# EAGLE schematic Artemis_Iridium_Tracker (EAGLE 9.5.2)

## Sheet 1 of 4
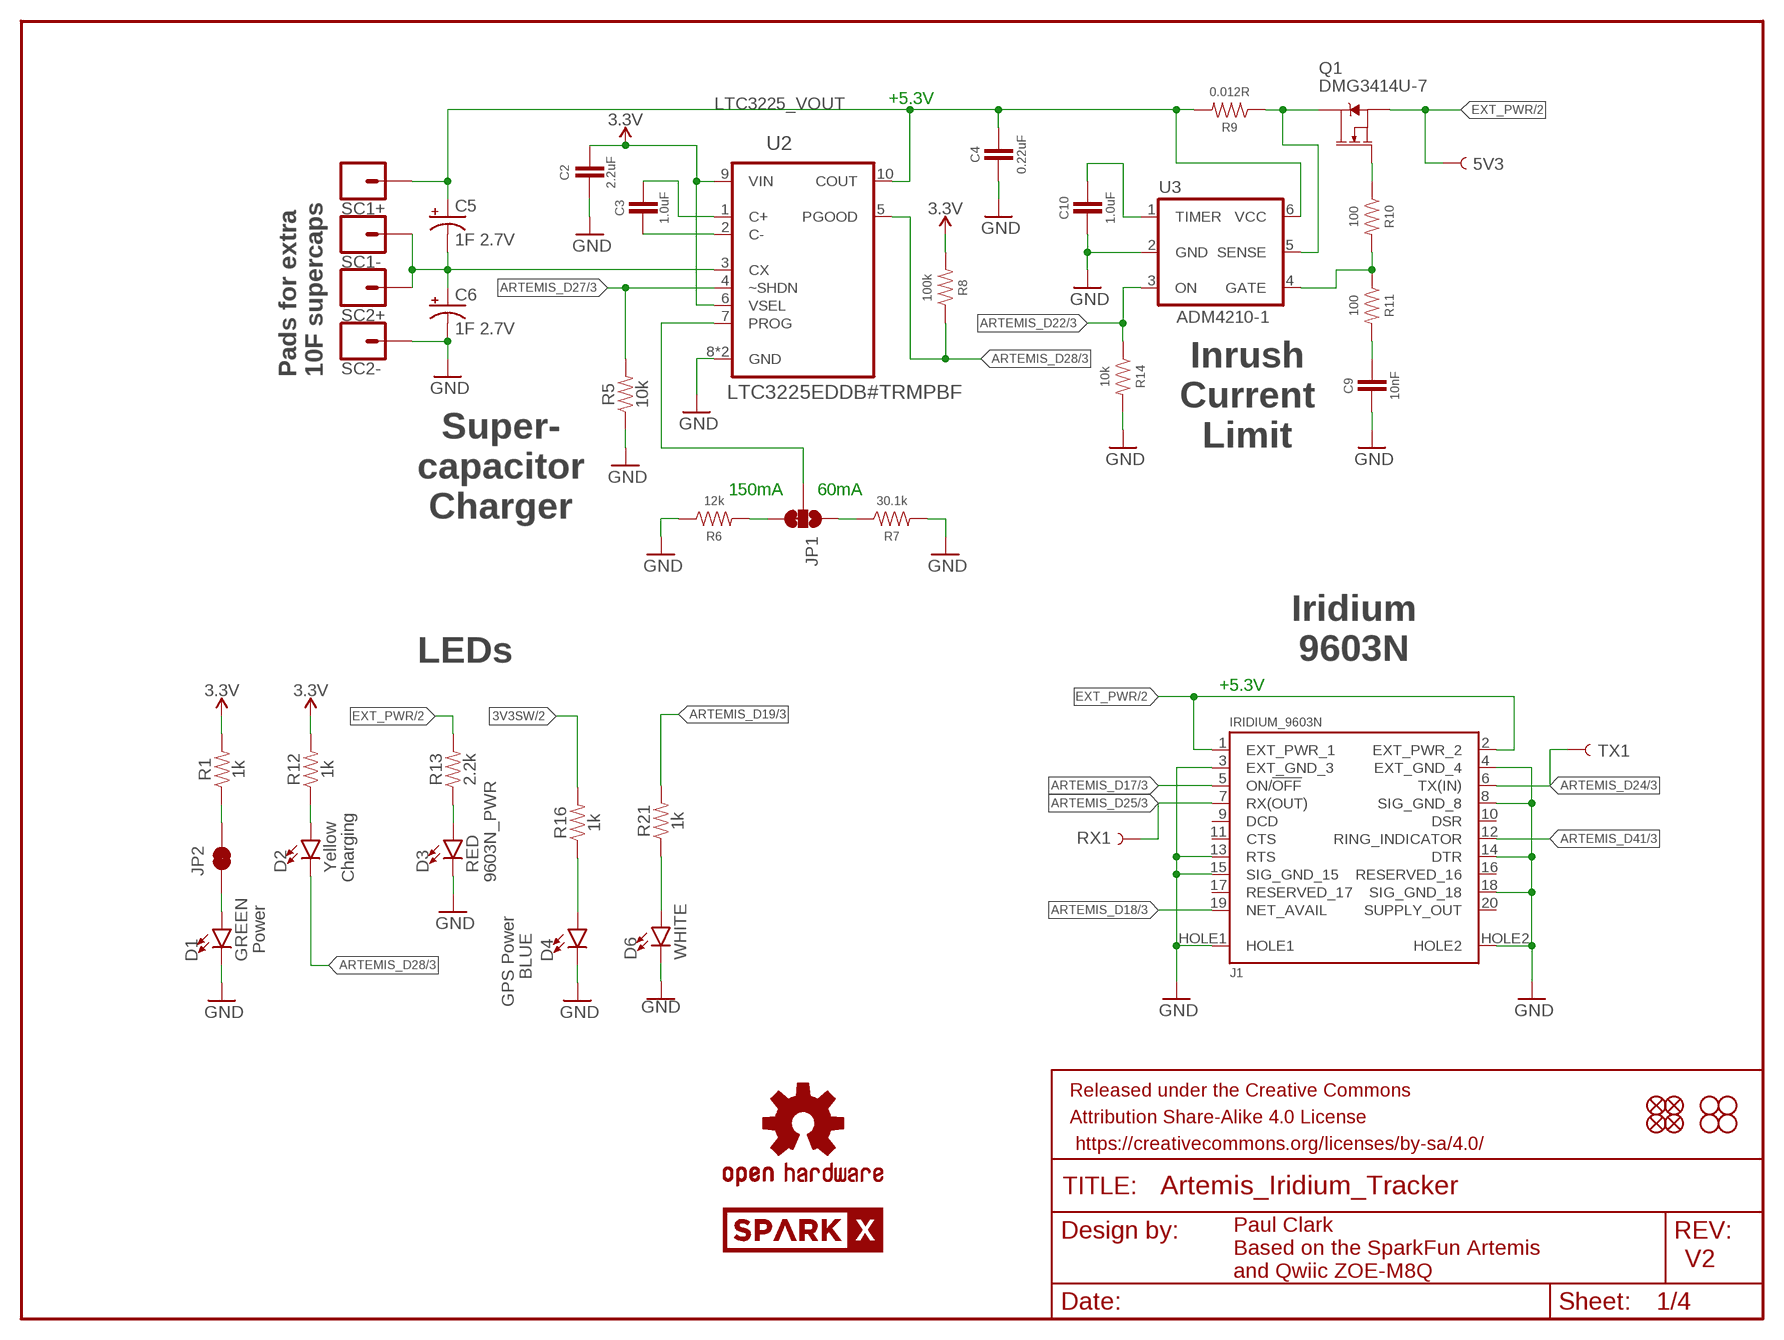
[diagram p0: schematic, sheet 1]

### Parts
5V3  TEST-POINT3X5  [PAD.03X.05]
C2  2.2uF  2.2UF-0603-10V-20%  [0603]
C3  1.0uF  1.0UF-0603-16V-10%-X7R  [0603]
C4  0.22uF  0.22UF-0603-25V-10%  [0603]
C5  1F 2.7V  1F-2.7V(PTH)CPOL-RADIAL-1H-2.7V  [CPOL-RADIAL-1F-2.7V]
C6  1F 2.7V  1F-2.7V(PTH)CPOL-RADIAL-1H-2.7V  [CPOL-RADIAL-1F-2.7V]
C9  10nF  10NF-0603-50V-10%  [0603]
C10  1.0uF  1.0UF-0603-16V-10%-X7R  [0603]
D1  GREEN  LED-GREEN0603  [LED-0603]
D2  Yellow  LED-YELLOW0603  [LED-0603]
D3  RED  LED-RED0603  [LED-0603]
D4  BLUE  LED-BLUE0603  [LED-0603]
D6  WHITE  LED-WHITE0603  [LED-0603]
FRAME1  FRAME-LETTER  [CREATIVE_COMMONS]
J1  IRIDIUM_9603N  [IRIDIUM_9603N]
JP1  JUMPER-SMT_3_1-NC_TRACE_SILK  [SMT-JUMPER_3_1-NC_TRACE_SILK]
JP2  JUMPER-SMT_2_NC_TRACE_SILK  [SMT-JUMPER_2_NC_TRACE_SILK]
JP7  FIDUCIAL1X2  [FIDUCIAL-1X2]
JP8  FIDUCIAL1X2  [FIDUCIAL-1X2]
JP9  STAND-OFF  [STAND-OFF]
JP10  STAND-OFF  [STAND-OFF]
JP11  STAND-OFF  [STAND-OFF]
JP12  STAND-OFF  [STAND-OFF]
JP13  FIDUCIAL1X2  [FIDUCIAL-1X2]
JP14  FIDUCIAL1X2  [FIDUCIAL-1X2]
LOGO4  OSHW-LOGOMINI  [OSHW-LOGO-MINI]
Q1  DMG3414U-7  [SOT23-R]
R1  1k  1KOHM-0603-1/10W-1%  [0603]
R5  10k  10KOHM-0603-1/10W-1%  [0603]
R6  12k  12KOHM-0603-1/10W-1%  [0603]
R7  30.1k  30.1KOHM-0603-1/10W-1%  [0603]
R8  100k  100KOHM-0603-1/10W-1%  [0603]
R9  0.012R  RESISTOR_0603_12MILLIOHM0603  [0603]
R10  100  100OHM-0603-1/10W-1%  [0603]
R11  100  100OHM-0603-1/10W-1%  [0603]
R12  1k  1KOHM-0603-1/10W-1%  [0603]
R13  2.2k  2.2KOHM-0603-1/10W-1%  [0603]
R14  10k  10KOHM-0603-1/10W-1%  [0603]
R16  1k  1KOHM-0603-1/10W-1%  [0603]
R21  1k  1KOHM-0603-1/10W-1%  [0603]
RX1  TEST-POINT3X5  [PAD.03X.05]
SC1+  CONN_01PTH_NO_SILK_YES_STOP  [1X01_NO_SILK]
SC1-  CONN_01PTH_NO_SILK_YES_STOP  [1X01_NO_SILK]
SC2+  CONN_01PTH_NO_SILK_YES_STOP  [1X01_NO_SILK]
SC2-  CONN_01PTH_NO_SILK_YES_STOP  [1X01_NO_SILK]
SPARKX1  SPARKX-LOGO4  [SPARKX-MEDIUM]
SPARKX2  SPARKX-LOGO4  [SPARKX-MEDIUM]
TX1  TEST-POINT3X5  [PAD.03X.05]
U2  LTC3225EDDB#TRMPBF  LTC3225EDDB-TRMPBFDFN300X200-10L  [DFN300X200-10L]
U3  ADM4210-1  [TSOT6]

### Nets
3.3V [3.3V]: C2.1 R1.2 R8.2 R12.2 U2.6(VSEL) U2.9(VIN) ; also sheet 2,3,4
3V3SW: R16.2 ; also sheet 2
ARTEMIS_D17: J1.5(ON/!OFF!) ; also sheet 3
ARTEMIS_D18: J1.19(NET_AVAIL) ; also sheet 3
ARTEMIS_D19: R21.2 ; also sheet 3
ARTEMIS_D22: R14.1 U3.3(ON) ; also sheet 3
ARTEMIS_D24: J1.6(TX(IN)) TX1.P$1 ; also sheet 3
ARTEMIS_D25: J1.7(RX(OUT)) RX1.P$1 ; also sheet 3
ARTEMIS_D27: R5.2 U2.4(~SHDN) ; also sheet 3
ARTEMIS_D28: D2.C R8.1 U2.5(PGOOD) ; also sheet 3
ARTEMIS_D41: J1.12(RING_INDICATOR) ; also sheet 3
EXT_PWR: 5V3.P$1 J1.1(EXT_PWR_1) J1.2(EXT_PWR_2) Q1.2(S) R13.2 ; also sheet 2
GND: C2.2 C4.2 C6.- C9.2 C10.2 D1.C D3.C D4.C D6.C J1.3(EXT_GND_3) J1.4(EXT_GND_4) J1.8(SIG_GND_8) J1.13(RTS) J1.14(DTR) J1.15(SIG_GND_15) J1.18(SIG_GND_18) J1.HOLE1 J1.HOLE2 R5.1 R6.1 R7.2 R14.2 SC2-.1 U2.8(GND) U2.11(GND) U3.2(GND) ; also sheet 2,3,4
LTC3225_VOUT: C4.1 C5.+ R9.2 SC1+.1 U2.10(COUT) U3.6(VCC)
N$1: C5.- C6.+ SC1-.1 SC2+.1 U2.3(CX)
N$2: JP1.3 R6.2
N$3: JP2.2 R1.1
N$4: JP1.1 R7.1
N$5: D2.A R12.1
N$6: D3.A R13.1
N$8: Q1.3(D) R9.1 U3.5(SENSE)
N$9: C3.2 U2.2(C-)
N$10: C3.1 U2.1(C+)
N$11: JP1.2 U2.7(PROG)
N$12: Q1.1(G) R10.1
N$13: R10.2 R11.1 U3.4(GATE)
N$14: C9.1 R11.2
N$15: C10.1 U3.1(TIMER)
N$21: D4.A R16.1
N$23: D1.A JP2.1
N$35: D6.A R21.1
Unconnected: J1.9(DCD) J1.10(DSR) J1.11(CTS) J1.16(RESERVED_16) J1.17(RESERVED_17) J1.20(SUPPLY_OUT)

### Notes on the sheet
- +5.3V
- Inrush
  Current
  Limit
- Pads for extra
  10F supercaps
- Super-
  capacitor
  Charger
- 150mA | 60mA
- Iridium
  9603N
- LEDs
- +5.3V
- Charging | 9603N_PWR
- Power
- GPS Power
- V2
- Paul Clark
  Based on the SparkFun Artemis
  and Qwiic ZOE-M8Q

## Sheet 2 of 4
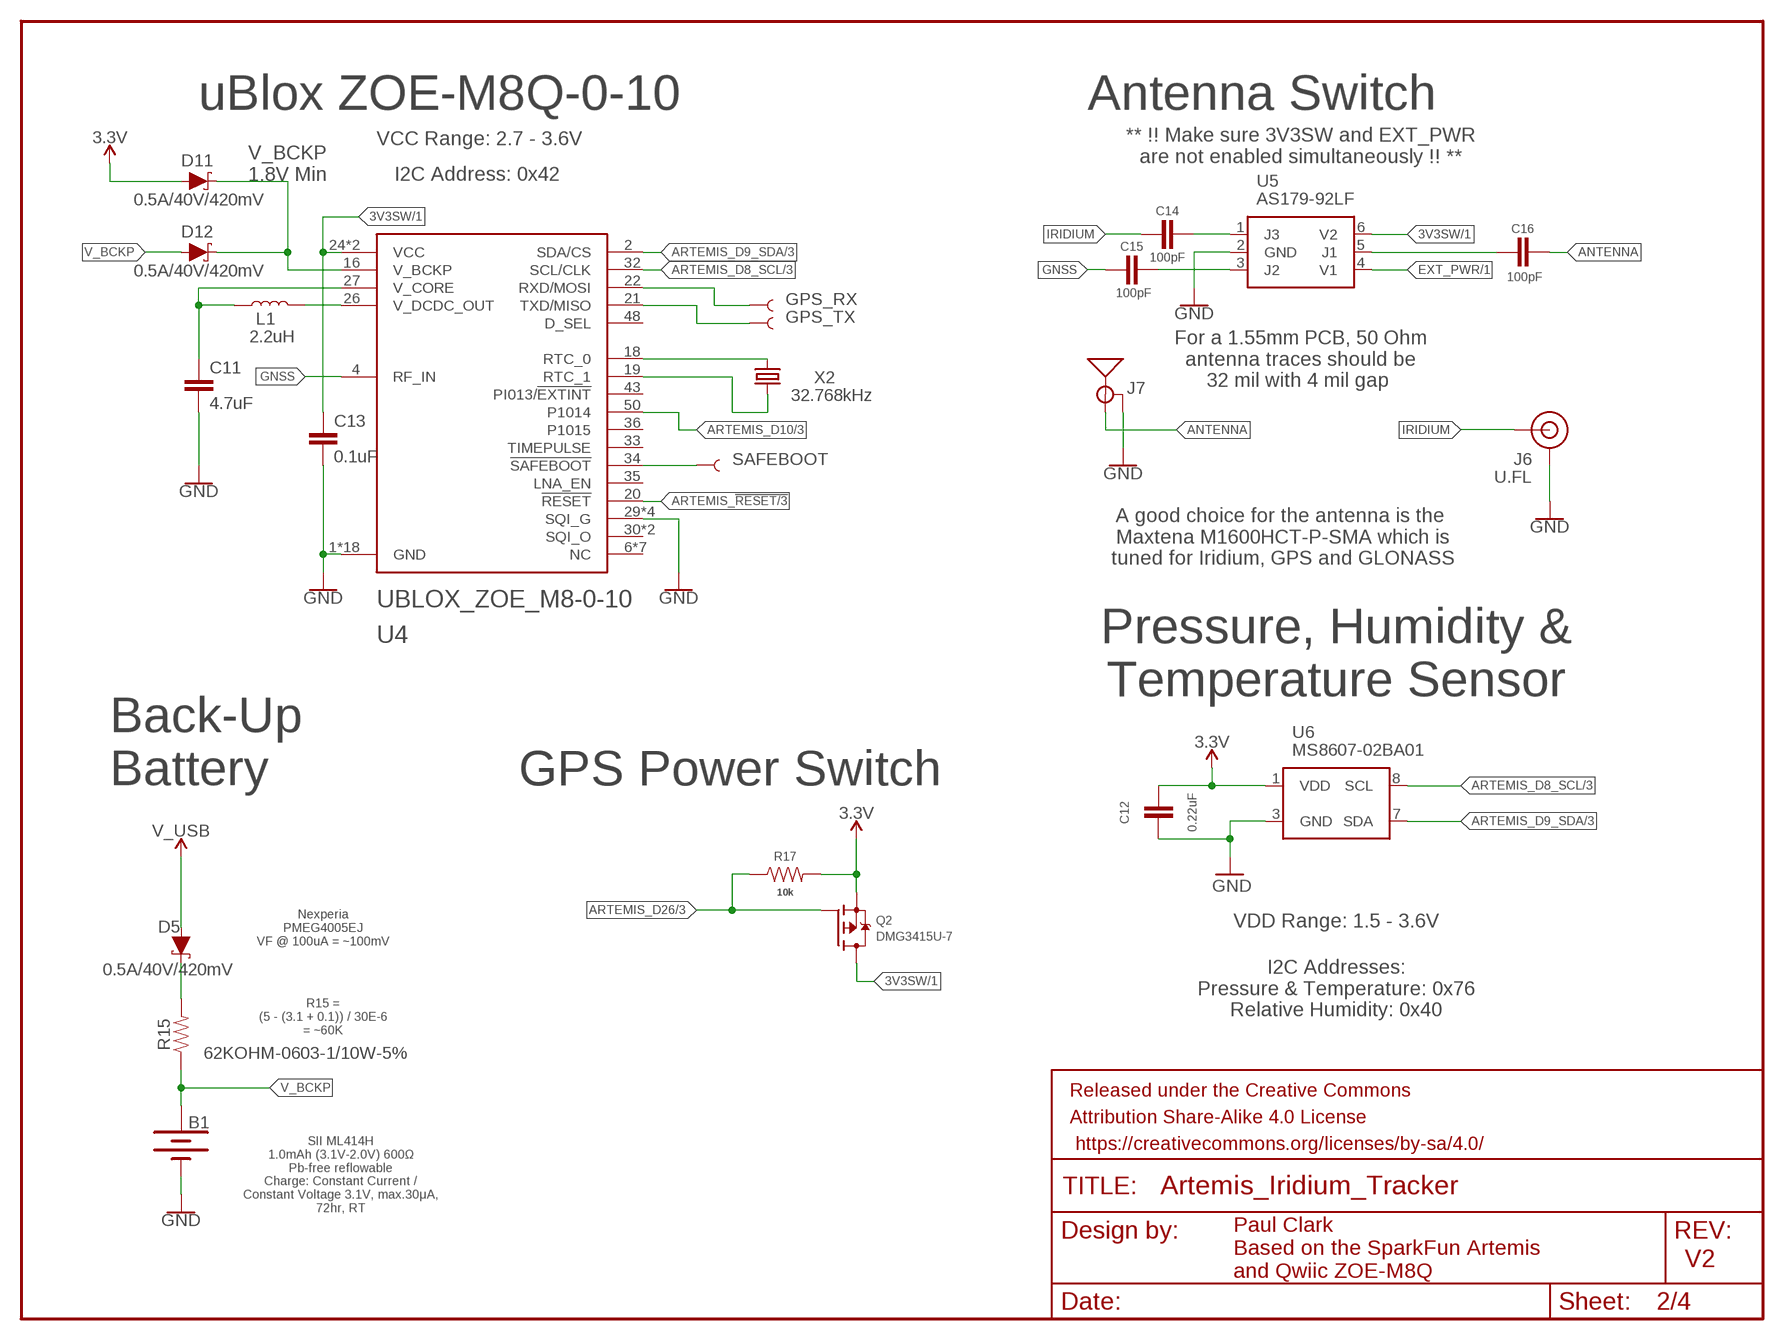
[diagram p1: schematic, sheet 2]

### Parts
B1  ML414H_IV01E_BATTERY  [ML414H_IV01E]
C11  4.7uF  4.7UF-0603-6.3V-(10%)  [0603]
C12  0.22uF  0.22UF-0603-25V-10%  [0603]
C13  0.1uF  0.1UF-0603-25V-(+80/-20%)  [0603]
C14  100pF  100PF-0603-50V-5%  [0603]
C15  100pF  100PF-0603-50V-5%  [0603]
C16  100pF  100PF-0603-50V-5%  [0603]
D5  0.5A/40V/420mV  DIODE-SCHOTTKY-PMEG4005EJ  [SOD-323]
D11  0.5A/40V/420mV  DIODE-SCHOTTKY-PMEG4005EJ  [SOD-323]
D12  0.5A/40V/420mV  DIODE-SCHOTTKY-PMEG4005EJ  [SOD-323]
FRAME2  FRAME-LETTER  [CREATIVE_COMMONS]
GPS_RX  TEST-POINT3X5  [PAD.03X.05]
GPS_TX  TEST-POINT3X5  [PAD.03X.05]
J6  U.FL  U.FL2PIN  [U.FL]
J7  ANTENNA-GROUNDEDEDGE_SMA  [SMA-EDGE]
L1  2.2uH  2.2μH_SHIELDED_INDUCTOR  [0806]
Q2  DMG3415U-7  DMG3415U  [SOT23-R]
R15  62KOHM-0603-1/10W-5%  [0603]
R17  10k  10KOHM-0603-1/10W-1%  [0603]
SAFEBOOT  TEST-POINT3X5  [PAD.03X.05]
U4  UBLOX_ZOE_M8-0-10  [UBLOX_ZOE_M8-0-10]
U5  AS179-92LF  [SOT65P220X100-6N]
U6  MS8607-02BA01  [MS8607-02BA01]
X2  32.768kHz  CRYSTAL-32.768KHZSMD-3.2X1.5  [CRYSTAL-SMD-3.2X1.5MM]

### Nets
3.3V [3.3V]: C12.1 D11.A Q2.2(S) R17.2 U6.1(VDD) ; also sheet 1,3,4
3V3SW: C13.1 Q2.3(D) U4.24(VCC) U4.25(VCC) U5.6(V2) ; also sheet 1
ANTENNA: C16.1 J7.SIG(SIGNAL)
ARTEMIS_!RESET: U4.20(!RESET) ; also sheet 3
ARTEMIS_D8_SCL: U4.32(SCL/CLK) U6.8(SCL) ; also sheet 3
ARTEMIS_D9_SDA: U4.2(SDA/CS) U6.7(SDA) ; also sheet 3
ARTEMIS_D10: U4.50(P1014) ; also sheet 3
ARTEMIS_D26: Q2.1(G) R17.1 ; also sheet 3
EXT_PWR: U5.4(V1) ; also sheet 1
GND: B1.- C11.2 C12.2 C13.2 J6.1(GND) J6.2(GND) J7.GND@0(GND) J7.GND@1(GND) J7.GND@2(GND) J7.GND@3(GND) U4.1(GND) U4.3(GND) U4.5(GND) U4.7(GND) U4.8(GND) U4.9(GND) U4.10(GND) U4.11(GND) U4.12(GND) U4.17(GND) U4.23(GND) U4.29(SQI_G) U4.31(SQI_G) U4.37(GND) U4.38(GND) U4.39(GND) U4.40(GND) U4.41(GND) U4.44(GND) U4.46(SQI_G) U4.47(SQI_G) U4.49(GND) U5.2(GND) U6.3(GND) ; also sheet 1,3,4
GNSS: C15.2 U4.4(RF_IN)
IRIDIUM: C14.2 J6.FEED(SIGNAL)
N$16: L1.2 U4.26(V_DCDC_OUT)
N$17: C11.1 L1.1 U4.27(V_CORE)
N$18: U4.18(RTC_0) X2.P$2
N$19: U4.19(RTC_1) X2.P$1
N$20: D5.C R15.2
N$24: D11.C D12.C U4.16(V_BCKP)
N$25: SAFEBOOT.P$1 U4.34(!SAFEBOOT)
N$26: GPS_RX.P$1 U4.22(RXD/MOSI)
N$27: GPS_TX.P$1 U4.21(TXD/MISO)
N$28: C14.1 U5.1(J3)
N$29: C15.1 U5.3(J2)
N$30: C16.2 U5.5(J1)
V_BCKP: B1.+ D12.A R15.1
V_USB: D5.A ; also sheet 4
Unconnected: U4.6(NC) U4.13(NC) U4.14(NC) U4.15(NC) U4.28(NC) U4.30(SQI_O) U4.33(TIMEPULSE) U4.35(LNA_EN) U4.36(P1015) U4.42(NC) U4.43(PI013/!EXTINT) U4.45(SQI_O) U4.48(D_SEL) U4.51(NC)

### Notes on the sheet
- uBlox ZOE-M8Q-0-10 | Antenna Switch
- VCC Range: 2.7 - 3.6V
- ** !! Make sure 3V3SW and EXT_PWR
  are not enabled simultaneously !! **
- V_BCKP
  1.8V Min
- I2C Address: 0x42
- For a 1.55mm PCB, 50 Ohm
  antenna traces should be
  32 mil with 4 mil gap
- A good choice for the antenna is the 
  Maxtena M1600HCT-P-SMA which is
  tuned for Iridium, GPS and GLONASS
- Pressure, Humidity &
  Temperature Sensor
- Back-Up
  Battery
- GPS Power Switch
- VDD Range: 1.5 - 3.6V
- Nexperia
  PMEG4005EJ
  VF @ 100uA = ~100mV
- I2C Addresses:
  Pressure & Temperature: 0x76
  Relative Humidity: 0x40
- R15 =
  (5 - (3.1 + 0.1)) / 30E-6
  = ~60K
- SII ML414H
  1.0mAh (3.1V-2.0V) 600Ω
  Pb-free reflowable
  Charge: Constant Current /
  Constant Voltage 3.1V, max.30μA,
  72hr, RT
- V2
- Paul Clark
  Based on the SparkFun Artemis
  and Qwiic ZOE-M8Q

## Sheet 3 of 4
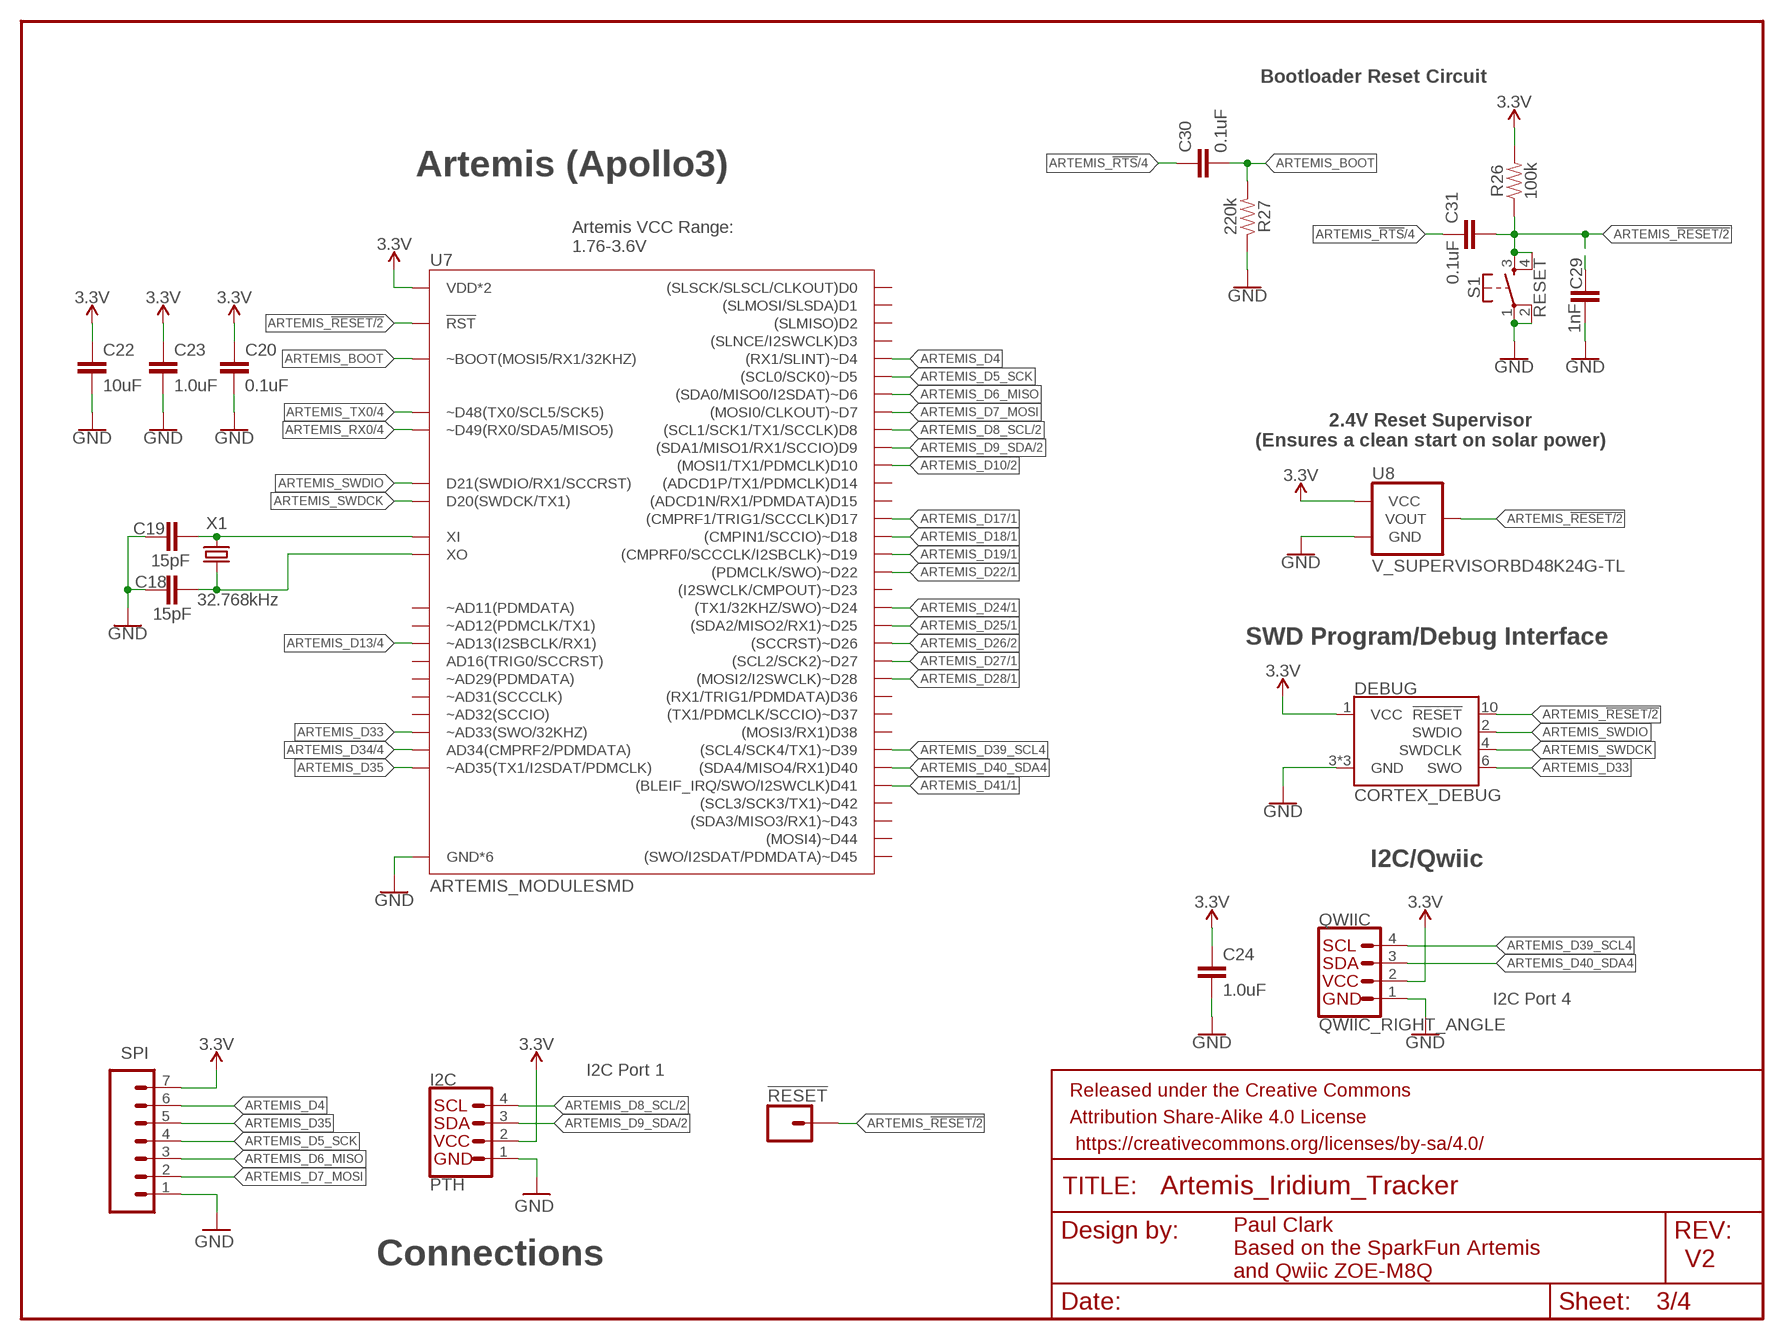
[diagram p2: schematic, sheet 3]

### Parts
!RESET  CONN_01PTH_NO_SILK_YES_STOP  [1X01_NO_SILK]
C18  15pF  15PF-0603-50V-5%  [0603]
C19  15pF  15PF-0603-50V-5%  [0603]
C20  0.1uF  0.1UF-0603-25V-(+80/-20%)  [0603]
C22  10uF  10UF-0603-6.3V-20%  [0603]
C23  1.0uF  1.0UF-0603-16V-10%  [0603]
C24  1.0uF  1.0UF-0603-16V-10%  [0603]
C29  1nF  1.0NF/1000PF-0603-50V-10%  [0603]
C30  0.1uF  0.1UF-0603-25V-5%  [0603]
C31  0.1uF  0.1UF-0603-25V-5%  [0603]
DEBUG  CORTEX_DEBUG  CORTEX_JTAG_DEBUG_MINIMUM_PTH_NS  [2X5-PTH-1.27MM-NO_SILK]
FRAME3  FRAME-LETTER  [CREATIVE_COMMONS]
I2C  PTH  I2C_STANDARD_NO_SILK  [1X04_NO_SILK]
QWIIC  QWIIC_RIGHT_ANGLE  QWIIC_CONNECTORJS-1MM  [JST04_1MM_RA]
R26  100k  100KOHM-0603-1/10W-1%  [0603]
R27  220k  220KOHM-0603-1/10W-1%  [0603]
S1  RESET  MOMENTARY-SWITCH-SPST-2-SMD-5.2MM-TALL  [TACTILE_SWITCH_SMD_5.2MM]
SPI  CONN_07NO_SILK  [1X07_NO_SILK]
U7  ARTEMIS_MODULESMD  [ARTEMIS_FP]
U8  V_SUPERVISORBD48K24G-TL  [SSOP3]
X1  32.768kHz  CRYSTAL-32.768KHZSMD-3.2X1.5  [CRYSTAL-SMD-3.2X1.5MM]

### Nets
3.3V [3.3V]: C20.2 C22.1 C23.1 C24.1 DEBUG.1(VCC) I2C.2 QWIIC.2 R26.2 SPI.7 U7.VDD@36(VDD*2) U7.VDD@37(VDD*2) U8.3(VCC) ; also sheet 1,2,4
ARTEMIS_!RESET: !RESET.1 C29.1 C31.2 DEBUG.10(!RESET) R26.1 S1.3 S1.4 U7.~RST(!RST) U8.2(VOUT) ; also sheet 2
ARTEMIS_!RTS!: C30.1 C31.1 ; also sheet 4
ARTEMIS_BOOT: C30.2 R27.2 U7.BOOT(~BOOT(MOSI5/RX1/32KHZ))
ARTEMIS_D4: SPI.6 U7.~D4((RX1/SLINT)~D4)
ARTEMIS_D5_SCK: SPI.4 U7.~D5((SCL0/SCK0)~D5)
ARTEMIS_D6_MISO: SPI.3 U7.~D6((SDA0/MISO0/I2SDAT)~D6)
ARTEMIS_D7_MOSI: SPI.2 U7.D7((MOSI0/CLKOUT)~D7)
ARTEMIS_D8_SCL: I2C.4 U7.D8((SCL1/SCK1/TX1/SCCLK)D8) ; also sheet 2
ARTEMIS_D9_SDA: I2C.3 U7.D9((SDA1/MISO1/RX1/SCCIO)D9) ; also sheet 2
ARTEMIS_D10: U7.D10((MOSI1/TX1/PDMCLK)D10) ; also sheet 2
ARTEMIS_D13: U7.~AD13(~AD13(I2SBCLK/RX1)) ; also sheet 4
ARTEMIS_D17: U7.D17((CMPRF1/TRIG1/SCCCLK)D17) ; also sheet 1
ARTEMIS_D18: U7.~D18((CMPIN1/SCCIO)~D18) ; also sheet 1
ARTEMIS_D19: U7.~D19((CMPRF0/SCCCLK/I2SBCLK)~D19) ; also sheet 1
ARTEMIS_D22: U7.~D22((PDMCLK/SWO)~D22) ; also sheet 1
ARTEMIS_D24: U7.~D24((TX1/32KHZ/SWO)~D24) ; also sheet 1
ARTEMIS_D25: U7.~D25((SDA2/MISO2/RX1)~D25) ; also sheet 1
ARTEMIS_D26: U7.~D26((SCCRST)~D26) ; also sheet 2
ARTEMIS_D27: U7.~D27((SCL2/SCK2)~D27) ; also sheet 1
ARTEMIS_D28: U7.~D28((MOSI2/I2SWCLK)~D28) ; also sheet 1
ARTEMIS_D33: DEBUG.6(SWO) U7.~AD33/SWO(~AD33(SWO/32KHZ))
ARTEMIS_D34: U7.AD34(AD34(CMPRF2/PDMDATA)) ; also sheet 4
ARTEMIS_D35: SPI.5 U7.~AD35(~AD35(TX1/I2SDAT/PDMCLK))
ARTEMIS_D39_SCL4: QWIIC.4 U7.~D39((SCL4/SCK4/TX1)~D39)
ARTEMIS_D40_SDA4: QWIIC.3 U7.D40((SDA4/MISO4/RX1)D40)
ARTEMIS_D41: U7.D41((BLEIF_IRQ/SWO/I2SWCLK)D41) ; also sheet 1
ARTEMIS_RX0: U7.RXI-0(~D49(RX0/SDA5/MISO5)) ; also sheet 4
ARTEMIS_SWDCK: DEBUG.4(SWDCLK) U7.SWDCK(D20(SWDCK/TX1))
ARTEMIS_SWDIO: DEBUG.2(SWDIO) U7.SWDIO(D21(SWDIO/RX1/SCCRST))
ARTEMIS_TX0: U7.TXO-0(~D48(TX0/SCL5/SCK5)) ; also sheet 4
GND: C18.1 C19.1 C20.1 C22.2 C23.2 C24.2 C29.2 DEBUG.3(GND) DEBUG.5(GND) DEBUG.9(GND) I2C.1 QWIIC.1 R27.1 S1.1 S1.2 SPI.1 U7.GND@1(GND*6) U7.GND@22(GND*6) U7.GND@38(GND*6) U7.GND@39(GND*6) U7.GND@47(GND*6) U7.GND@59(GND*6) U8.1(GND) ; also sheet 1,2,4
XTALI: C19.2 U7.XI X1.P$1
XTALO: C18.2 U7.XO X1.P$2
Unconnected: U7.AD16(AD16(TRIG0/SCCRST)) U7.D0((SLSCK/SLSCL/CLKOUT)D0) U7.D1((SLMOSI/SLSDA)D1) U7.D2((SLMISO)D2) U7.D3((SLNCE/I2SWCLK)D3) U7.D14((ADCD1P/TX1/PDMCLK)D14) U7.D15((ADCD1N/RX1/PDMDATA)D15) U7.D36((RX1/TRIG1/PDMDATA)D36) U7.D38((MOSI3/RX1)D38) U7.~AD11(~AD11(PDMDATA)) U7.~AD12(~AD12(PDMCLK/TX1)) U7.~AD29(~AD29(PDMDATA)) U7.~AD31(~AD31(SCCCLK)) U7.~AD32(~AD32(SCCIO)) U7.~D23((I2SWCLK/CMPOUT)~D23) U7.~D37((TX1/PDMCLK/SCCIO)~D37) U7.~D42((SCL3/SCK3/TX1)~D42) U7.~D43((SDA3/MISO3/RX1)~D43) U7.~D44((MOSI4)~D44) U7.~D45((SWO/I2SDAT/PDMDATA)~D45)

### Notes on the sheet
- Bootloader Reset Circuit
- Artemis (Apollo3)
- Artemis VCC Range:
  1.76-3.6V
- 2.4V Reset Supervisor
  (Ensures a clean start on solar power)
- SWD Program/Debug Interface
- I2C/Qwiic
- I2C Port 4
- I2C Port 1
- Connections | V2
- Paul Clark
  Based on the SparkFun Artemis
  and Qwiic ZOE-M8Q

## Sheet 4 of 4
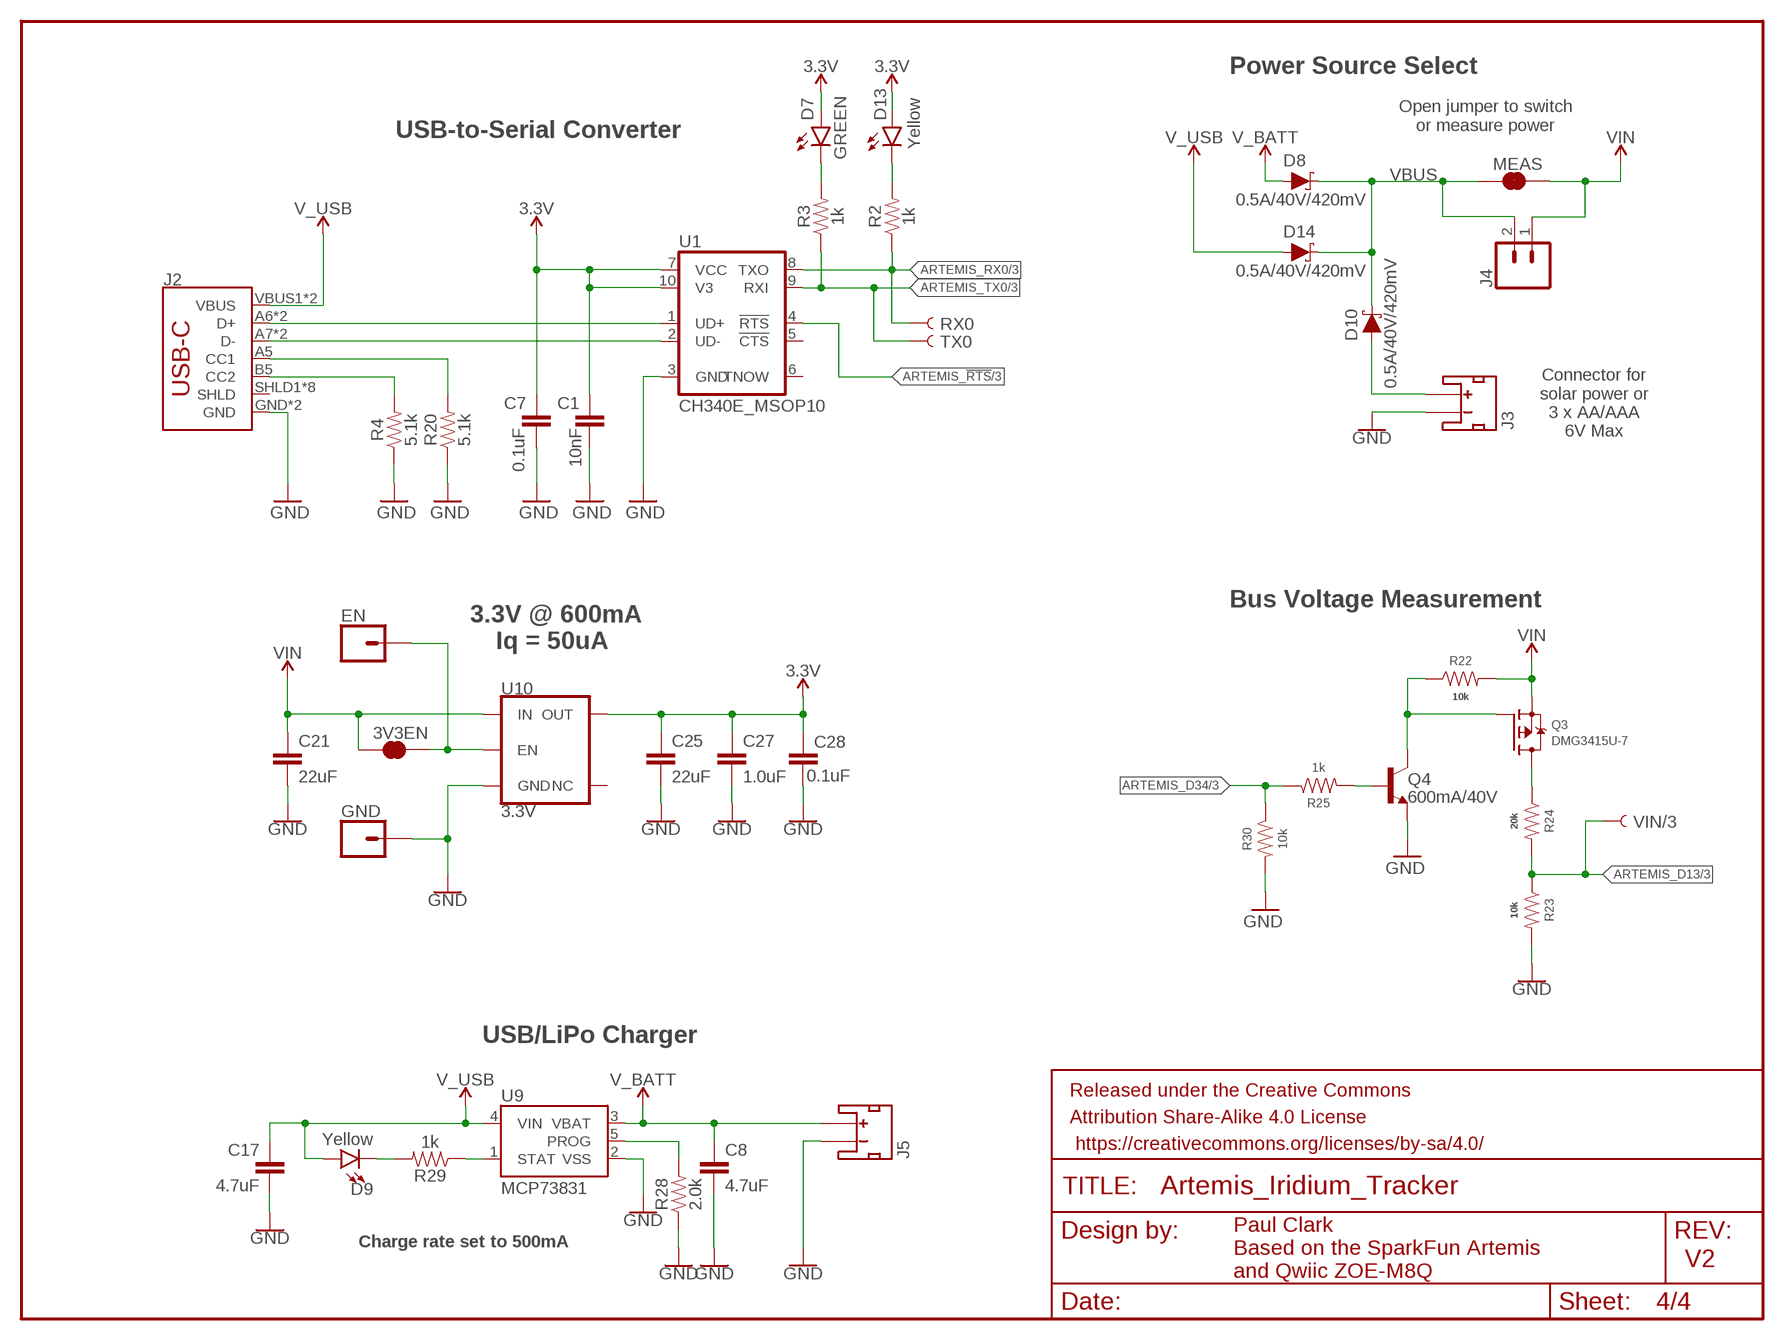
[diagram p3: schematic, sheet 4]

### Parts
3V3EN  JUMPER-SMT_2_NC_TRACE_SILK  [SMT-JUMPER_2_NC_TRACE_SILK]
C1  10nF  10NF-0603-50V-10%  [0603]
C7  0.1uF  0.1UF-0603-25V-(+80/-20%)  [0603]
C8  4.7uF  4.7UF-0603-6.3V-(10%)  [0603]
C17  4.7uF  4.7UF-0603-6.3V-(10%)  [0603]
C21  22uF  22UF-0805-16V-20%  [0805]
C25  22uF  22UF-0603-6.3V-20%  [0603]
C27  1.0uF  1.0UF-0603-16V-10%  [0603]
C28  0.1uF  0.1UF-0603-25V-(+80/-20%)  [0603]
D7  GREEN  LED-GREEN0603  [LED-0603]
D8  0.5A/40V/420mV  DIODE-SCHOTTKY-PMEG4005EJ  [SOD-323]
D9  Yellow  LED-YELLOW0603  [LED-0603]
D10  0.5A/40V/420mV  DIODE-SCHOTTKY-PMEG4005EJ  [SOD-323]
D13  Yellow  LED-YELLOW0603  [LED-0603]
D14  0.5A/40V/420mV  DIODE-SCHOTTKY-PMEG4005EJ  [SOD-323]
EN  CONN_01PTH_NO_SILK_YES_STOP  [1X01_NO_SILK]
FRAME4  FRAME-LETTER  [CREATIVE_COMMONS]
GND  CONN_01PTH_NO_SILK_YES_STOP  [1X01_NO_SILK]
J2  USB-C  USB_C2-LAYER  [USB-C-16P]
J3  JST_2MM_MALE  [JST-2-SMD]
J4  CONN_021X02_NO_SILK  [1X02_NO_SILK]
J5  JST_2MM_MALE  [JST-2-SMD]
MEAS  JUMPER-SMT_2_NC_TRACE_SILK  [SMT-JUMPER_2_NC_TRACE_SILK]
Q3  DMG3415U-7  DMG3415U  [SOT23-R]
Q4  600mA/40V  TRANS_NPN-MMBT2222AL  [SOT23-3]
R2  1k  1KOHM-0603-1/10W-1%  [0603]
R3  1k  1KOHM-0603-1/10W-1%  [0603]
R4  5.1k  5.1KOHM5.1KOHM-0603-1/10W-1%  [0603]
R20  5.1k  5.1KOHM5.1KOHM-0603-1/10W-1%  [0603]
R22  10k  10KOHM-0603-1/10W-1%  [0603]
R23  10k  10KOHM-0603-1/10W-1%  [0603]
R24  20k  20KOHM-0603-1/10W-1%  [0603]
R25  1k  1KOHM-0603-1/10W-1%  [0603]
R28  2.0k  2.0KOHM-0603-1/10W-5%  [0603]
R29  1k  1KOHM-0603-1/10W-1%  [0603]
R30  10k  10KOHM-0603-1/10W-1%  [0603]
RX0  TEST-POINT3X5  [PAD.03X.05]
TX0  TEST-POINT3X5  [PAD.03X.05]
U1  CH340E_MSOP10  [MSOP10]
U9  MCP73831  [SOT23-5]
U10  3.3V  V_REG_AP2112K-3.3V  [SOT23-5]
VIN/3  TEST-POINT3X5  [PAD.03X.05]

### Nets
3.3V [3.3V]: C1.1 C7.1 C25.1 C27.1 C28.1 D7.A D13.A U1.7(VCC) U1.10(V3) U10.5(OUT) ; also sheet 1,2,3
ARTEMIS_!RTS!: U1.4(!RTS) ; also sheet 3
ARTEMIS_D13: R23.1 R24.2 VIN/3.P$1 ; also sheet 3
ARTEMIS_D34: R25.1 R30.1 ; also sheet 3
ARTEMIS_RX0: R2.1 RX0.P$1 U1.8(TXO) ; also sheet 3
ARTEMIS_TX0: R3.1 TX0.P$1 U1.9(RXI) ; also sheet 3
CC3: J2.B5(CC2) R4.2
CC4: J2.A5(CC1) R20.2
D+2: J2.A6(D+) J2.B6(D+) U1.1(UD+)
D-2: J2.A7(D-) J2.B7(D-) U1.2(UD-)
GND: C1.2 C7.2 C8.2 C17.2 C21.2 C25.2 C27.2 C28.2 GND.1 J2.GND J2.GND2(GND) J3.1(-) J5.1(-) Q4.2(E) R4.1 R20.1 R23.2 R28.1 R30.2 U1.3(GND) U9.2(VSS) U10.2(GND) ; also sheet 1,2,3
N$22: D13.C R2.2
N$32: D7.C R3.2
N$36: 3V3EN.2 EN.1 U10.3(EN)
N$37: Q3.1(G) Q4.3(C) R22.1
N$39: R28.2 U9.5(PROG)
N$40: D9.C R29.2
N$41: R29.1 U9.1(STAT)
N$46: Q3.3(D) R24.1
N$47: Q4.1(B) R25.2
V_AAA: D10.A J3.2(+)
V_BATT: C8.1 D8.A J5.2(+) U9.3(VBAT)
V_USB: C17.1 D9.A D14.A J2.VBUS1(VBUS) J2.VBUS2(VBUS) U9.4(VIN) ; also sheet 2
VBUS: D8.C D10.C D14.C J4.2 MEAS.1
VIN: 3V3EN.1 C21.1 J4.1 MEAS.2 Q3.2(S) R22.2 U10.1(IN)
Unconnected: J2.SHLD1(SHLD) J2.SHLD2(SHLD) J2.SHLD3(SHLD) J2.SHLD4(SHLD) J2.SHLD5(SHLD) J2.SHLD6(SHLD) J2.SHLD7(SHLD) J2.SHLD8(SHLD) J3.NC1(PAD1) J3.NC2(PAD2) J5.NC1(PAD1) J5.NC2(PAD2) U1.5(!CTS) U1.6(TNOW) U10.4(NC)

### Notes on the sheet
- Power Source Select
- USB-to-Serial Converter
- Open jumper to switch
  or measure power
- Connector for
  solar power or
  3 x AA/AAA
  6V Max
- Bus Voltage Measurement
- 3.3V @ 600mA
  Iq = 50uA
- USB/LiPo Charger
- Charge rate set to 500mA
- V2
- Paul Clark
  Based on the SparkFun Artemis
  and Qwiic ZOE-M8Q

## Library data of the parts
3V3EN JP2 MEAS = SparkFun-Jumpers:JUMPER-SMT_2_NC_TRACE: Normally closed trace jumper This jumper has a trace between two pads so it's normally closed (NC). Use a razor knife to open the connection. For best results follow the IPC guidelines for cutting traces: Cutout at least 0.063 mm (0.005 in). Remove all loose material to clean up the cut area. Seal the cut with an approved epoxy. Reapply solder to reclose the connection.
5V3 GPS_RX GPS_TX RX0 RX1 SAFEBOOT TX0 TX1 VIN/3 = SparkFun-Connectors:TEST-POINT: SparkFun Test Points Bare copper test points for troubleshooting or In-Circuit-Testing. These are used by our Production team for verifying production board runs using pogo-pins on test beds. SparkFun Products: SparkFun LSM9DS1 Breakout <https://www.sparkfun.com/products/13284> SparkFun PSOC <https://www.sparkfun.com/products/13714> SparkFun Load Cell Amplifier <https://www.sparkfun.com/products/13879>
!RESET EN GND SC1+ SC1- SC2+ SC2- = SparkFun-Connectors:CONN_01: Single connection point. Often used as Generic Header-pin footprint for 0.1 inch spaced/style header connections On any of the 0.1 inch spaced packages, you can populate with these: Break Away Headers - Straight <https://www.sparkfun.com/products/116> (PRT-00116) Break Away Male Headers - Right Angle <https://www.sparkfun.com/products/553> (PRT-00553) Female Headers <https://www.sparkfun.com/products/115> (PRT-00115) Break Away Headers - Machine Pin <https://www.sparkfun.com/products/117> (PRT-00117) Break Away Female Headers - Swiss Machine Pin <https://www.sparkfun.com/products/743> (PRT-00743) This device is also useful as a general connection point to wire up your design to another part of your project. Our various solder wires solder well into these plated through hole pads. Hook-Up Wire - Assortment (Stranded, 22 AWG) <https://www.sparkfun.com/products/11375> (PRT-11375) Hook-Up Wire - Assortment (Solid Core, 22 AWG) <https://www.sparkfun.com/products/11367> (PRT-11367) View the entire wire category on our website here <https://www.sparkfun.com/categories/141> Special notes: SMTSO-256-ET is a "flush mount" nut for a 4-40 screw. We mostly use this on specialty testbeds; it is a nice way to connect hardware to your PCB at an adjustable hieght. Also note, the SNAP packages are for using a snappable style connector. We sell a baggie of snaps and they are also used on two LilyPad designs: Snap Assortment - 30 pack (male and female) <https://www.sparkfun.com/products/11347> (DEV-11347) LilyPad Arduino SimpleSnap <https://www.sparkfun.com/products/10941> (DEV-10941) LilyPad SimpleSnap Protoboard <https://www.sparkfun.com/products/10940> (DEV-10940)
B1 = SparkFun-Batteries:ML414H_IV01E_BATTERY: SEIKO ML414H-IV01E Reflowable Lithium Battery ML414H is a rechargeable, coin type battery with features such as Pb-free reflowable (Peak temperature: 260 C) and high temperature heat resistance. Battery Characteristics: 3.1V max voltage Voff is 2V 1mAH 3k series resistor with battery 72 hour charge time from 2.0-3.1V 2.3-2.8V initial charge; PROD_ID: BATT-14267
C1 C9 = SparkFun-Capacitors:10NF: 0.01uF/10nF/10,000pF ceramic capacitors A capacitor is a passive two-terminal electrical component used to store electrical energy temporarily in an electric field. CAP-09321; PROD_ID: CAP-00867
C2 = SparkFun-Capacitors:2.2UF: 2.2µF ceramic capacitors A capacitor is a passive two-terminal electrical component used to store electrical energy temporarily in an electric field.; PROD_ID: CAP-07888
C3 C10 = SparkFun-Capacitors:1.0UF: 1µF ceramic capacitors A capacitor is a passive two-terminal electrical component used to store electrical energy temporarily in an electric field.; PROD_ID: CAP-13930
C4 C12 = SparkFun-Capacitors:0.22UF: 0.22µF ceramic capacitors A capacitor is a passive two-terminal electrical component used to store electrical energy temporarily in an electric field.; PROD_ID: CAP-07822
C5 C6 = SparkFun-Capacitors:1F-2.7V(PTH): CAP-08070
C7 C13 C20 C28 = SparkFun-Capacitors:0.1UF: 0.1µF ceramic capacitors A capacitor is a passive two-terminal electrical component used to store electrical energy temporarily in an electric field.; PROD_ID: CAP-00810
C8 C11 C17 = SparkFun-Capacitors:4.7UF: 4.7µF ceramic capacitors A capacitor is a passive two-terminal electrical component used to store electrical energy temporarily in an electric field.; PROD_ID: CAP-08280
C14-C16 = SparkFun-Capacitors:100PF: 100pF/0.1nF ceramic capacitors A capacitor is a passive two-terminal electrical component used to store electrical energy temporarily in an electric field.; PROD_ID: CAP-07883
C18 C19 = SparkFun-Capacitors:15PF: 15pF ceramic capacitors A capacitor is a passive two-terminal electrical component used to store electrical energy temporarily in an electric field.; PROD_ID: CAP-07881
C21 = SparkFun-Capacitors:22UF: 22µF ceramic capacitors A capacitor is a passive two-terminal electrical component used to store electrical energy temporarily in an electric field.; PROD_ID: CAP-14260
C22 = SparkFun-Capacitors:10UF: 10.0µF ceramic capacitors A capacitor is a passive two-terminal electrical component used to store electrical energy temporarily in an electric field.; PROD_ID: CAP-11015
C23 C24 C27 = SparkFun-Capacitors:1.0UF: 1µF ceramic capacitors A capacitor is a passive two-terminal electrical component used to store electrical energy temporarily in an electric field.; PROD_ID: CAP-00868
C25 = SparkFun-Capacitors:22UF: 22µF ceramic capacitors A capacitor is a passive two-terminal electrical component used to store electrical energy temporarily in an electric field.; PROD_ID: CAP-14464
C29 = SparkFun-Capacitors:1.0NF/1000PF: 1nF/1,000pF ceramic capacitors A capacitor is a passive two-terminal electrical component used to store electrical energy temporarily in an electric field.; PROD_ID: CAP-07886
C30 C31 = SparkFun-Capacitors:0.1UF: 0.1µF ceramic capacitors A capacitor is a passive two-terminal electrical component used to store electrical energy temporarily in an electric field.; PROD_ID: CAP-08604
D1 D7 = SparkFun-LED:LED-GREEN: Green SMD LED Used in manufacturing of various products at SparkFun Packages: 0603 - SMD 0603 package [Product Link] <http://www.futureelectronics.com/en/technologies/semiconductors/optoelectronics/leds/Pages/9894312-LTST-C190GKT.aspx?CrossPart=HSMG-C190&IM=0> LilyPad 1206 - SMD1206 LilyPad package [Product Link] <http://www.futureelectronics.com/en/Technologies/Product.aspx?ProductID=IN150NGHARVATEKCORPORATION2049943&IM=0> 1206 - SMD1206 package [Product Link] <http://www.futureelectronics.com/en/technologies/semiconductors/optoelectronics/leds/Pages/8315665-LTST-C150KGKT.aspx?IM=0> 1206 Bottom Mount -SMD 1206 Bottom Mount [Product Link] <http://www.digikey.com/product-detail/en/lite-on-inc/LTST-C230KGKT/160-1456-1-ND/386854> SparkFun Products: Pro Mini 328 -5V <https://www.sparkfun.com/products/821> RedBoard <https://www.sparkfun.com/products/12757> MP3 Trigger <https://www.sparkfun.com/products/13720> Makey Makey <https://www.sparkfun.com/products/11076>; PROD_ID: DIO-00821
D2 D9 D13 = SparkFun-LED:LED-YELLOW: Yellow SMD LED Used in manufacturing several products at SparkFun. Packages: 0603 - SMD 0603 package[Product Link] <http://www.kingbrightusa.com/product.asp?catalog_name=LED&product_id=APT1608SYCK> 0603 -SMART - SMART SMD 0603 package (more efficient/more expensive) [Product Link] <http://www.osram-os.com/osram_os/en/products/product-catalog/led-light-emitting-diodes/smartled-0603/ly-l29k/index.jsp> LilyPad - SMD1206 package[Product Datasheet] <https://www.sparkfun.com/datasheets/DevTools/LilyPad/Q150YUS4.pdf> SparkFun Products: Blynk Board <https://www.sparkfun.com/products/13794> IOIO-OTG <https://www.sparkfun.com/products/13613> XBee Explorer Serial <https://www.sparkfun.com/products/13225>; PROD_ID: DIO-09003
D3 = SparkFun-LED:LED-RED: Red SMD LED Used in manufacturing of most products at SparkFun Packages: 0603 - SMD 0603 package [Product Link] <http://docs.avagotech.com/docs/AV02-0551EN> 0603 SMART - SMD 0603 SMART package ( more efficient and expensive)[Product Link] <http://www.osram-os.com/Graphics/XPic2/00077099_0.pdf> 1206 - SMD1206 package [Product Link] <https://www.sparkfun.com/datasheets/DevTools/LilyPad/Q150OVS4.pdff> SparkFun Products: Pro Mini 328 -5V <https://www.sparkfun.com/products/821> RedBoard <https://www.sparkfun.com/products/12757> IOIO-OTG <https://www.sparkfun.com/products/13613>; PROD_ID: DIO-00819
D4 = SparkFun-LED:LED-BLUE: Blue SMD LED Used in manufacturing of various products at SparkFun Packages: 0603 - SMD 0603 package [Product Link] <http://www.digikey.com/product-detail/en/SMLE12BC7TT86/511-1589-2-ND/1641808> 1206 - SMD1206 package [Product Link] <http://www.digikey.com/product-detail/en/lite-on-inc/LTST-C150TBKT/160-1643-1-ND/573584> SparkFun Products: ESP8266 Thing-Dev Board <https://www.sparkfun.com/products/13711> RedBoard <https://www.sparkfun.com/products/12757>; PROD_ID: DIO-08575
D5 D8 D10-D12 D14 = SparkFun-DiscreteSemi:DIODE-SCHOTTKY: Schottky diode A Schottky diode is a semiconductor diode which has a low forward voltage drop and a very fast switching action.; PROD_ID: DIO-10955
D6 = SparkFun-LED:LED-WHITE: White SMD LED Used in manufacturing several products at SparkFun. Packages: 0603 - Bright White SMD 0603 package[Product Link] <http://www.kingbrightusa.com/product.asp?catalog_name=LED&product_id=APT1608QWF/D> 1206 - Bright White SMD1206 package [Product Link] <http://www.kingbrightusa.com/product.asp?catalog_name=LED&product_id=APT3216QWF/D> 3014 - Super Bright SMD 3014 package [Datasheet] <http://www.lumileds.com/uploads/459/DS208-pdf> SparkFun Products: Blackberry Trackballer Breakout <https://www.sparkfun.com/products/13169> Digital SandBox <https://www.sparkfun.com/products/12651>; PROD_ID: DIO-09004
DEBUG = SparkFun-Connectors:CORTEX_JTAG_DEBUG_MINIMUM: Cortex Debug Connector - 10 pin Supports JTAG debug, Serial Wire debug, and Serial Wire Viewer. PTH and SMD connector options available. General Connector Information <http://infocenter.arm.com/help/topic/com.arm.doc.faqs/attached/13634/cortex_debug_connectors.pdf> Products: PTH Connector <http://www.digikey.com/product-detail/en/cnc-tech/3220-10-0100-00/1175-1627-ND/3883661> -via Digi-Key SparkFun PSoc <https://www.sparkfun.com/products/13229> SparkFun T <https://www.sparkfun.com/products/13810>
FRAME1-FRAME4 = SparkFun-Aesthetics:FRAME-LETTER: Schematic Frame - Letter Standard 8.5x11 US Letter frame
I2C = SparkFun-Connectors:I2C_STANDARD: SparkFun I2C Standard Pinout Header SparkFun has standardized on a pinout for all I2C based sensor breakouts. This pinout allows I2C boards to be plugged directly into the headers on Arduino Uno compatible boards, and to be daisy chained easily. Example SparkFun Products: SparkFun Atmospheric Sensor Breakout - BME280 <https://www.sparkfun.com/products/13676> SparkFun Altitude/Pressure Sensor Breakout - MPL3115A2 <https://www.sparkfun.com/products/11084> SparkFun TOF Range Finder Sensor - VL6180 <https://www.sparkfun.com/products/12785>
J1 = New_Parts:IRIDIUM_9603N: Iridium 9603N with two McMaster 95117A411 press-fit nuts
J2 = SparkFun-Connectors:USB_C: USB Type C 16Pin Connector Super Speed pins not available on the 16-pin purely SMD connector so this part is best for USB 2.0 implementations. D1 and D2 are tied together enabling D+/- no matter which way the cable is plugged into the connector. The two channel configuration pins (CC1/2) are exposed. These are normally connected to ground via 5.1k resistors but can be reconfigured for high current/high power applications.; PROD_ID: CONN-14122
J3 J5 = SparkFun-Connectors:JST_2MM_MALE: JST 2MM MALE RA CONNECTOR Two pin, compact surface mount connector. Commonly used as a battery input connection point. We really like the solid locking feeling and high current rating on these small connectors. We use these all the time as battery connectors. Mates to single-cell LiPo batteries. Here is the connector we sell at SparkFun: JST Right Angle Connector - White <https://www.sparkfun.com/products/8612> (PRT-08612) Datasheet <http://www.sparkfun.com/datasheets/Prototyping/Connectors/JST-Horizontal.pdf> It was used on these SparkFun products: SparkFun MOSFET Power Controller <https://www.sparkfun.com/products/11214> (PRT-11214) SparkFun Battery Babysitter - LiPo Battery Manager <https://www.sparkfun.com/products/13777> (PRT-13777) And many, many others that required a lipo battery connection.; PROD_ID: CONN-11443; SF_ID: PRT-08612
J4 = SparkFun-Connectors:CONN_02: Multi connection point. Often used as Generic Header-pin footprint for 0.1 inch spaced/style header connections On any of the 0.1 inch spaced packages, you can populate with these: Break Away Headers - Straight <https://www.sparkfun.com/products/116> (PRT-00116) Break Away Male Headers - Right Angle <https://www.sparkfun.com/products/553> (PRT-00553) Female Headers <https://www.sparkfun.com/products/115> (PRT-00115) Break Away Headers - Machine Pin <https://www.sparkfun.com/products/117> (PRT-00117) Break Away Female Headers - Swiss Machine Pin <https://www.sparkfun.com/products/743> (PRT-00743) For SCREWTERMINALS and SPRING TERMINALS visit here: Screw Terimnals on SparkFun.com <https://www.sparkfun.com/search/results?term=Screw+Terminals> (5mm/3.5mm/2.54mm spacing) This device is also useful as a general connection point to wire up your design to another part of your project. Our various solder wires solder well into these plated through hole pads. Hook-Up Wire - Assortment (Stranded, 22 AWG) <https://www.sparkfun.com/products/11375> (PRT-11375) Hook-Up Wire - Assortment (Solid Core, 22 AWG) <https://www.sparkfun.com/products/11367> (PRT-11367) View the entire wire category on our website here <https://www.sparkfun.com/categories/141> Special notes: Molex polarized connector foot print use with: PRT-08233 with associated crimp pins and housings. 2.54_SCREWTERM for use with PRT-10571. 3.5mm Screw Terminal footprints for PRT-08084 5mm Screw Terminal footprints for use with PRT-08432
J6 = SparkFun-Connectors:U.FL2PIN: SMD Antenna Connector - U.FL 2mm height, 3.0mm x 3.0mm receptacle size. SparkFun Products: SparkFun WiFi Shield - ESP8266 <https://www.sparkfun.com/products/13287> SparkFun ESP8266 Thing <https://www.sparkfun.com/products/13231> SparkFun MiniGen - Pro Mini Signal Generator Shield <https://www.sparkfun.com/products/11420>; PROD_ID: CONN-09193; SF_ID: WRL-09144
J7 = SparkFun-RF:ANTENNA-GROUNDED: Antenna w/ Ground Connection 2.4GHz antennae with signal and ground terminals. TRACE_ANTENNA_2.4GHZ_15.2MM - Meander Trace antenna 15.2 x 5.7mm footprint Based on layout from TI app note AN043 <http://www.ti.com/lit/an/swra117d/swra117d.pdf>. TRACE_ANTENNA_2.4GHZ_25.7MM - Inverted F trace antenna 25.7 x 7.5 mm footprint. Based on layout from TI design note DN0007 <http://www.ti.com/lit/an/swru120b/swru120b.pdf>.; PROD_ID: CONN-08289
JP1 = SparkFun-Jumpers:JUMPER-SMT_3_1-NC_TRACE: Normally closed trace jumper (1 of 2 connections) This jumper has a trace between two pads so it's normally closed (NC). The other connection is normally open (NO). Use a razor knife to open the connection. For best results follow the IPC guidelines for cutting traces: Cutout at least 0.063 mm (0.005 in). Remove all loose material to clean up the cut area. Seal the cut with an approved epoxy. Reapply solder to reclose the connection, or to close the NO connection.
JP7 JP8 JP13 JP14 = SparkFun-Aesthetics:FIDUCIAL: Fiducial Alignment Points Point-of-reference for pick-and-place machines and other optical instruments.
JP9-JP12 = SparkFun-Hardware:STAND-OFF: Stand Off Drill holes for mechanically mounting via screws, standoffs, etc. Note: Use the keepout ring to avoid running the screw head into surrounding components. Variant Overviews STAND-OFF - Mechanical footprint for a #4 phillips button head screw. STAND-OFF-TIGHT - Mechanical footprint for a #4 phillips button head screw, Example SparkFun Products Screw - Phillips Head (1/4", 4-40, 10 pack) <https://www.sparkfun.com/products/10453> (PRT-10453) Screw - Phillips Head (1/2", 4-40, 10 pack) <https://www.sparkfun.com/products/10452> (PRT-10452) Screw - Phillips Head (3/4", 4-40, 10 pack) <https://www.sparkfun.com/products/10451> (PRT-10451) Screw - Phillips Head (1", 4-40, 10 pack) <https://www.sparkfun.com/products/10450> (PRT-10450)
L1 = SparkFun-Coils:2.2μH_SHIELDED_INDUCTOR: Murata 2.2uH Inductor 2.2uH 1.2A 110mOhm 0806 Package Shielded; PROD_ID: NDUC-14257
LOGO4 = SparkFun-Aesthetics:OSHW-LOGO: Open-Source Hardware (OSHW) Logo This logo indicates the piece of hardware it is found on incorporates a OSHW license and/or adheres to the definition of open source hardware found here: http://freedomdefined.org/OSHW
Q1 = New_Parts:DMG3414U-7: Diodes Inc DMG3414U-7 N-channel MOSFET Transistor, 4.2 A, 20 V, 3-Pin SOT-23 Source: Datasheet <https://www.diodes.com/products/discrete/mosfets/mosfet-master-table/n-channel/n-channel-8v-to-29v/part/DMG3414U>
Q2 Q3 = New_Parts:DMG3415U: Diodes Inc DMG3415U P-channel MOSFET Transistor, 4.0 A, 20 V, 3-Pin SOT-23 Source: Datasheet <https://www.diodes.com/assets/Datasheets/ds31735.pdf>; DESCRIPTION: Diodes Inc DMG3415U P-channel MOSFET Transistor, 4.0 A, 20 V, 3-Pin SOT-23; HEIGHT: 1.1mm; MANUFACTURER: Diodes Inc.; MANUFACTURER_PART_NUMBER: DMG3415U
Q4 = SparkFun-DiscreteSemi:TRANS_NPN: NPN transistor Current controlled devices typically used to amplify current or used as a switch. BC547 - COM-08928 <http://www.sparkfun.com/products/8928> (TO-92 45V 100mA) (1.Collector 2.Base 3.Emitter) 2N3904 - COM-00521 <http://www.sparkfun.com/products/521> (TO-92 40V 200mA) (1.Emitter 2.Base 3.Collector) P2N2222A - COM-12852 <http://www.sparkfun.com/products/12852> (TO-92 40V 600mA) (1.Collector 2.Base 3.Emitter); PROD_ID: TRANS-08049
QWIIC = SparkFun-Connectors:QWIIC_CONNECTOR: SparkFun I2C Standard Qwiic Connector An SMD 1mm pitch JST connector makes it easy and quick (get it? Qwiic?) to connect I2C devices to each other. The Qwiic system <http://www.sparkfun.com/qwiic> enables fast and solderless connection between popular platforms and various sensors and actuators. We carry 200mm <https://www.sparkfun.com/products/14204>, 100mm <https://www.sparkfun.com/products/14205>, 50mm <https://www.sparkfun.com/products/14206>, and breadboard friendly <https://www.sparkfun.com/products/14207> Qwiic cables. We also offer 10 pcs strips <https://www.sparkfun.com/products/14323> the SMD connectors.; PROD_ID: CONN-13694
R1-R3 R12 R16 R21 R25 R29 = SparkFun-Resistors:1KOHM: 1kΩ resistor A resistor is a passive two-terminal electrical component that implements electrical resistance as a circuit element. Resistors act to reduce current flow, and, at the same time, act to lower voltage levels within circuits. - Wikipedia; PROD_ID: RES-07856
R4 R20 = SparkFun-Resistors:5.1KOHM; PROD_ID: RES-12083
R5 R14 R17 R22 R23 R30 = SparkFun-Resistors:10KOHM: 10kΩ resistor A resistor is a passive two-terminal electrical component that implements electrical resistance as a circuit element. Resistors act to reduce current flow, and, at the same time, act to lower voltage levels within circuits. - Wikipedia; PROD_ID: RES-00824
R6 = SparkFun-Resistors:12KOHM: 12kΩ resistor A resistor is a passive two-terminal electrical component that implements electrical resistance as a circuit element. Resistors act to reduce current flow, and, at the same time, act to lower voltage levels within circuits. - Wikipedia; PROD_ID: RES-10327
R7 = SparkFun-Resistors:30.1KOHM: 30.1kΩ resistor A resistor is a passive two-terminal electrical component that implements electrical resistance as a circuit element. Resistors act to reduce current flow, and, at the same time, act to lower voltage levels within circuits. - Wikipedia; PROD_ID: RES-08595
R8 R26 = SparkFun-Resistors:100KOHM: 100kΩ resistor A resistor is a passive two-terminal electrical component that implements electrical resistance as a circuit element. Resistors act to reduce current flow, and, at the same time, act to lower voltage levels within circuits. - Wikipedia; PROD_ID: RES-07828
R9 = New_Parts:RESISTOR_0603_12MILLIOHM: Generic Resistor Package
R10 R11 = SparkFun-Resistors:100OHM: 100Ω resistor A resistor is a passive two-terminal electrical component that implements electrical resistance as a circuit element. Resistors act to reduce current flow, and, at the same time, act to lower voltage levels within circuits. - Wikipedia; PROD_ID: RES-07863
R13 = SparkFun-Resistors:2.2KOHM: 2.2kΩ resistor A resistor is a passive two-terminal electrical component that implements electrical resistance as a circuit element. Resistors act to reduce current flow, and, at the same time, act to lower voltage levels within circuits. - Wikipedia; PROD_ID: RES-08272
R15 = SparkFun-Resistors:62KOHM: 62kΩ resistor A resistor is a passive two-terminal electrical component that implements electrical resistance as a circuit element. Resistors act to reduce current flow, and, at the same time, act to lower voltage levels within circuits. - Wikipedia
R24 = SparkFun-Resistors:20KOHM: 20kΩ resistor A resistor is a passive two-terminal electrical component that implements electrical resistance as a circuit element. Resistors act to reduce current flow, and, at the same time, act to lower voltage levels within circuits. - Wikipedia; PROD_ID: RES-09383
R27 = SparkFun-Resistors:220KOHM: 220kΩ resistor A resistor is a passive two-terminal electrical component that implements electrical resistance as a circuit element. Resistors act to reduce current flow, and, at the same time, act to lower voltage levels within circuits. - Wikipedia; PROD_ID: RES-08969
R28 = SparkFun-Resistors:2.0KOHM: 2kΩ resistor A resistor is a passive two-terminal electrical component that implements electrical resistance as a circuit element. Resistors act to reduce current flow, and, at the same time, act to lower voltage levels within circuits. - Wikipedia; PROD_ID: RES-08296
S1 = SparkFun-Switches:MOMENTARY-SWITCH-SPST-2: Momentary Switch (Pushbutton) - SPST - Two Circuits Normally-open (NO) SPST momentary switches (buttons, pushbuttons). Schematic symbol includes two switch circuits. Variants SMD-4.6MMX2.8MM - 4.60mm x 2.80mm Tactile Momentary Button Switch - Used on SparkFun SAMD21 Mini Breakout <https://www.sparkfun.com/products/13664> SMD-5.2MM - Mini Pushbutton Switch - SMD <https://www.sparkfun.com/products/8720> - Used on Arduino Pro Mini <https://www.sparkfun.com/products/11114>; PROD_ID: SWCH-14139
SPARKX1 SPARKX2 = SparkX:SPARKX-LOGO
SPI = SparkFun-Connectors:CONN_07: Multi connection point. Often used as Generic Header-pin footprint for 0.1 inch spaced/style header connections On any of the 0.1 inch spaced packages, you can populate with these: Break Away Headers - Straight <https://www.sparkfun.com/products/116> (PRT-00116) Break Away Male Headers - Right Angle <https://www.sparkfun.com/products/553> (PRT-00553) Female Headers <https://www.sparkfun.com/products/115> (PRT-00115) Break Away Headers - Machine Pin <https://www.sparkfun.com/products/117> (PRT-00117) Break Away Female Headers - Swiss Machine Pin <https://www.sparkfun.com/products/743> (PRT-00743) For SCREWTERMINALS and SPRING TERMINALS visit here: Screw Terimnals on SparkFun.com <https://www.sparkfun.com/search/results?term=Screw+Terminals> (5mm/3.5mm/2.54mm spacing) This device is also useful as a general connection point to wire up your design to another part of your project. Our various solder wires solder well into these plated through hole pads. Hook-Up Wire - Assortment (Stranded, 22 AWG) <https://www.sparkfun.com/products/11375> (PRT-11375) Hook-Up Wire - Assortment (Solid Core, 22 AWG) <https://www.sparkfun.com/products/11367> (PRT-11367) View the entire wire category on our website here <https://www.sparkfun.com/categories/141> Special notes: Molex polarized connector foot print use with SKU : PRT-08231 with associated crimp pins and housings. 1MM SMD Version SKU: PRT-10208 NOTES ON THE VARIANTS LOCK and LOCK_LONGPADS... This footprint was designed to help hold the alignment of a through-hole component (i.e. 6-pin header) while soldering it into place. You may notice that each hole has been shifted either up or down by 0.005 of an inch from it's more standard position (which is a perfectly straight line). This slight alteration caused the pins (the squares in the middle) to touch the edges of the holes. Because they are alternating, it causes a "brace" to hold the component in place. 0.005 has proven to be the perfect amount of "off-center" position when using our standard breakaway headers. Although looks a little odd when you look at the bare footprint, once you have a header in there, the alteration is very hard to notice. Also,if you push a header all the way into place, it is covered up entirely on the bottom side.
U1 = SparkFun-IC-Comms:CH340E; PROD_ID: IC-14135
U2 = New_Parts:LTC3225EDDB-TRMPBF: 150mA Supercapacitor Charger
U3 = New_Parts:ADM4210
U4 = SparkFun-GPS:UBLOX_ZOE_M8-0-10: UBLOX ZOE-M8Q-0-10 u-blox ZOE-M8 standard precision GNSS SiP (System in Package) modules feature the high performance u-blox M8 GNSS engine. ZOE-M8’s ultra-miniature form factor integrates a complete GNSS receiver including SAW filter, LNA and TCXO. Handles all GNSS systems and can simulatenously use up to three of them, with accuracy ranging from 2.5m to 4m. GPS GLONASS BeiDou Galileo This can be corrected with the SBAS or QZSS augmentation systems.; PROD_ID: IC-14251
U5 = New_Parts:AS179-92LF: SKYWORKS SOLUTIONS - AS179-92LF - IC, SWITCH, RF, SPDT, 0.02-3.0GHZ Source: Datasheet <http://www.skyworksinc.com/uploads/documents/AS179_92LF_200176H.pdf>; ARROW_PART_NUMBER: AS179-92LF; DESCRIPTION: SKYWORKS SOLUTIONS - AS179-92LF - IC, SWITCH, RF, SPDT, 0.02-3.0GHZ; HEIGHT: 1mm; MANUFACTURER_NAME: Skyworks; MANUFACTURER_PART_NUMBER: AS179-92LF
U6 = New_Parts:MS8607-02BA01: PHT Combination Sensor Source: Datasheet <http://www.te.com/commerce/DocumentDelivery/DDEController?Action=showdoc&DocId=Data SheetMS8607-02BA01BpdfEnglishENG_DS_MS8607-02BA01_B.pdfCAT-BLPS0018>; DESCRIPTION: PHT Combination Sensor; HEIGHT: mm; MANUFACTURER_NAME: TE Connectivity; MANUFACTURER_PART_NUMBER: MS8607-02BA01
U7 = SparkFun-IC-Microcontroller:ARTEMIS_MODULE: Description: The Artemis Module from SparkFun is a Cortex-M4F with BLE 5.0 running up to 96MHz and with as low power as 6uA per MHz (less than 5mW). This is the world's first module to bridge the market between hobbyists and consumer products. We've packaged all the power of a modern microcontroller into a module that is both extremely easy to use but is mass-market ready. The flexibility of the Artemis module starts with our [Arduino core](https://github.com/sparkfun/Arduino_Apollo3). You can program and use the Artemis module just like you would an Uno or any other Arduino. Time to first blink is just 5 minutes away! We built the core from the ground up, making it fast and as light weight as possible.; PROD_ID: SUB-14402
U8 = New_Parts:V_SUPERVISOR: BD48xxx - Voltage Detector IC ROHM’s BD48xxx and BD49xxx series are highly accurate, low-current Voltage Detector IC series. The family includes BD48xxx devices with N-channel open drain output and BD49xxx devices with CMOS output. The devices are available for specific detection voltages ranging from 2.3V to 6.0V in increments of 0.1V.; DIGIKEY: BD48K24G-TLCT-ND; MOUSER: 755-BD48K24G-TL; VOLTAGE: 2.4V
U9 = SparkFun-IC-Power:MCP73831: MCP73831T Li-Ion, Li-Pol Controller Miniature single cell, fully integrated Li-Ion, Li-polymer charge management controller Datasheet <http://ww1.microchip.com/downloads/en/DeviceDoc/20001984g.pdf> SparkFun Products: SparkFun ESP32 Thing <https://www.sparkfun.com/products/13907> SparkFun 9DoF Razor IMU M0 <https://www.sparkfun.com/products/14001>; PROD_ID: IC-09995
U10 = SparkFun-IC-Power:V_REG_AP2112: AP2112 - 600mA CMOS LDO Regulator w/ Enable The AP2112 is CMOS process low dropout linear regulator with enable function, the regulator delivers a guaranteed 600mA (min.) continuous load current. Features Output Voltage Accuracy: ±1.5% Output Current: 600mA (Min.) Foldback Short Current Protection: 50mA Enable Function to Turn ON/OFF VOUT Low Dropout Voltage (3.3V): 250mV (Typ.) @IOUT=600mA Excellent Load Regulation: 0.2%/A (Typ.) Excellent Line Regulation: 0.02%/V (Typ.) Low Quiescent Current: 55μA (Typ.) Low Standby Current: 0.01μA (Typ.) Low Output Noise: 50μVRMS PSRR: 100Hz -65dB, 1kHz -65dB OTSD Protection Stable with 1.0μF Flexible Cap: Ceramic, Tantalum and Aluminum Electrolytic Operation Temperature Range: -40°C to 85°C ESD: MM 400V, HBM 4000V; PROD_ID: VREG-12457
X1 X2 = SparkFun-Clocks:CRYSTAL-32.768KHZ: 32.768kHz Crystal Frequency: 32.768kHz Frequency Stability: ±20ppm Load Capacitance: 12.5pF (PTH-2X6 & SMD-3.2X1.5), 6pF (SMD-2X6) SparkFun Products: SparkFun BigTime Watch Kit <https://www.sparkfun.com/products/11734> SparkFun nRF52832 Breakout <https://www.sparkfun.com/products/13990> SparkFun Real Time Clock Module <https://www.sparkfun.com/products/12708>; PROD_ID: XTAL-13062

## Net classes
1 3.3V: width 0.203 mm